# Altium schematic sheet BlockDiagram.SchDoc: Block Diagram
size Letter; Organization: Midnight Sun Solar Rayce Car Team; Address1: University of Waterloo; Address2: 200 University Ave W; Address3: Waterloo, ON, Canada; Address4: N2L 3E9; SheetNumber: 1; SheetTotal: 4; Website: www.uwmidsun.com
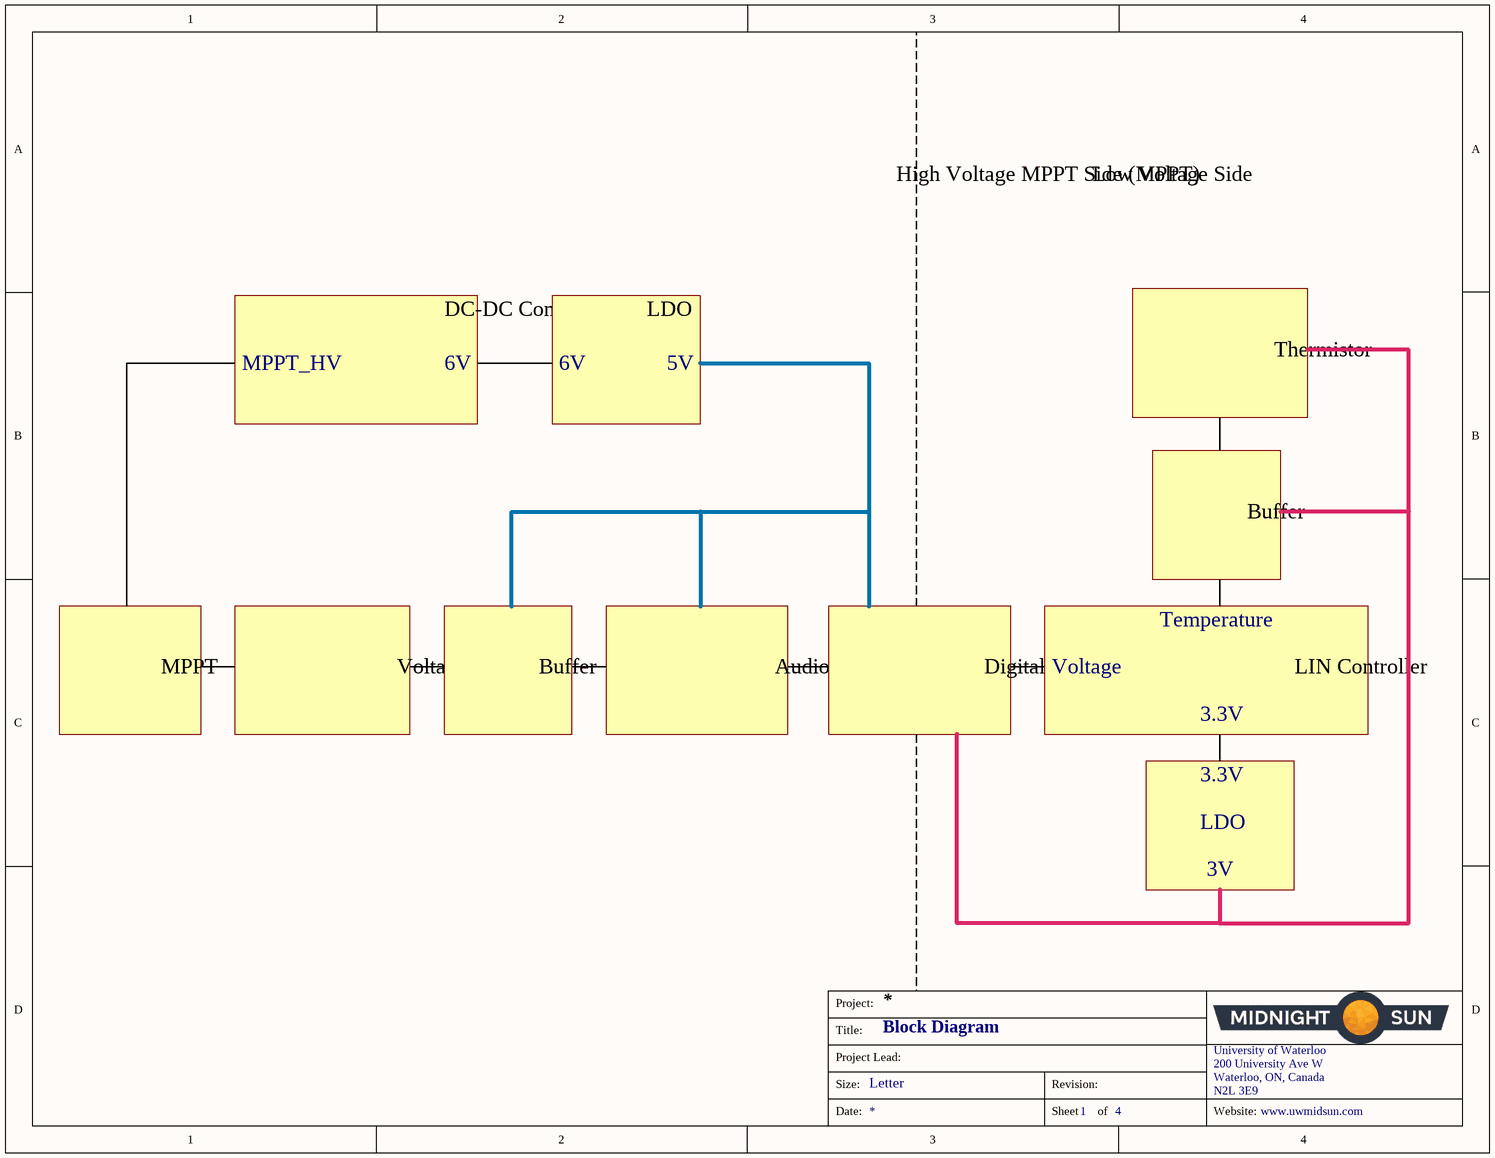
[diagram p0: BlockDiagram.SchDoc]

## Notes on the sheet
- High Voltage MPPT Side (MPPT)
- Low Voltage Side
- MPPT_HV
- DC-DC Converter
- 6V
- LDO
- 5V
- Thermistor
- Buffer
- Temperature
- MPPT
- Voltage Divider
- Audio Amplifier
- Digital Isolator
- Voltage
- LIN Controller
- 3.3V
- 3V
- Project:
- Title:
- Size:
- Project Lead:
- Letter
- Revision:
- University of Waterloo
- 200 University Ave W
- Waterloo, ON, Canada
- N2L 3E9
- Date:
- Sheet
- of
- Website: